# EAGLE design micromouse_schematic (EAGLE 8.6.3)
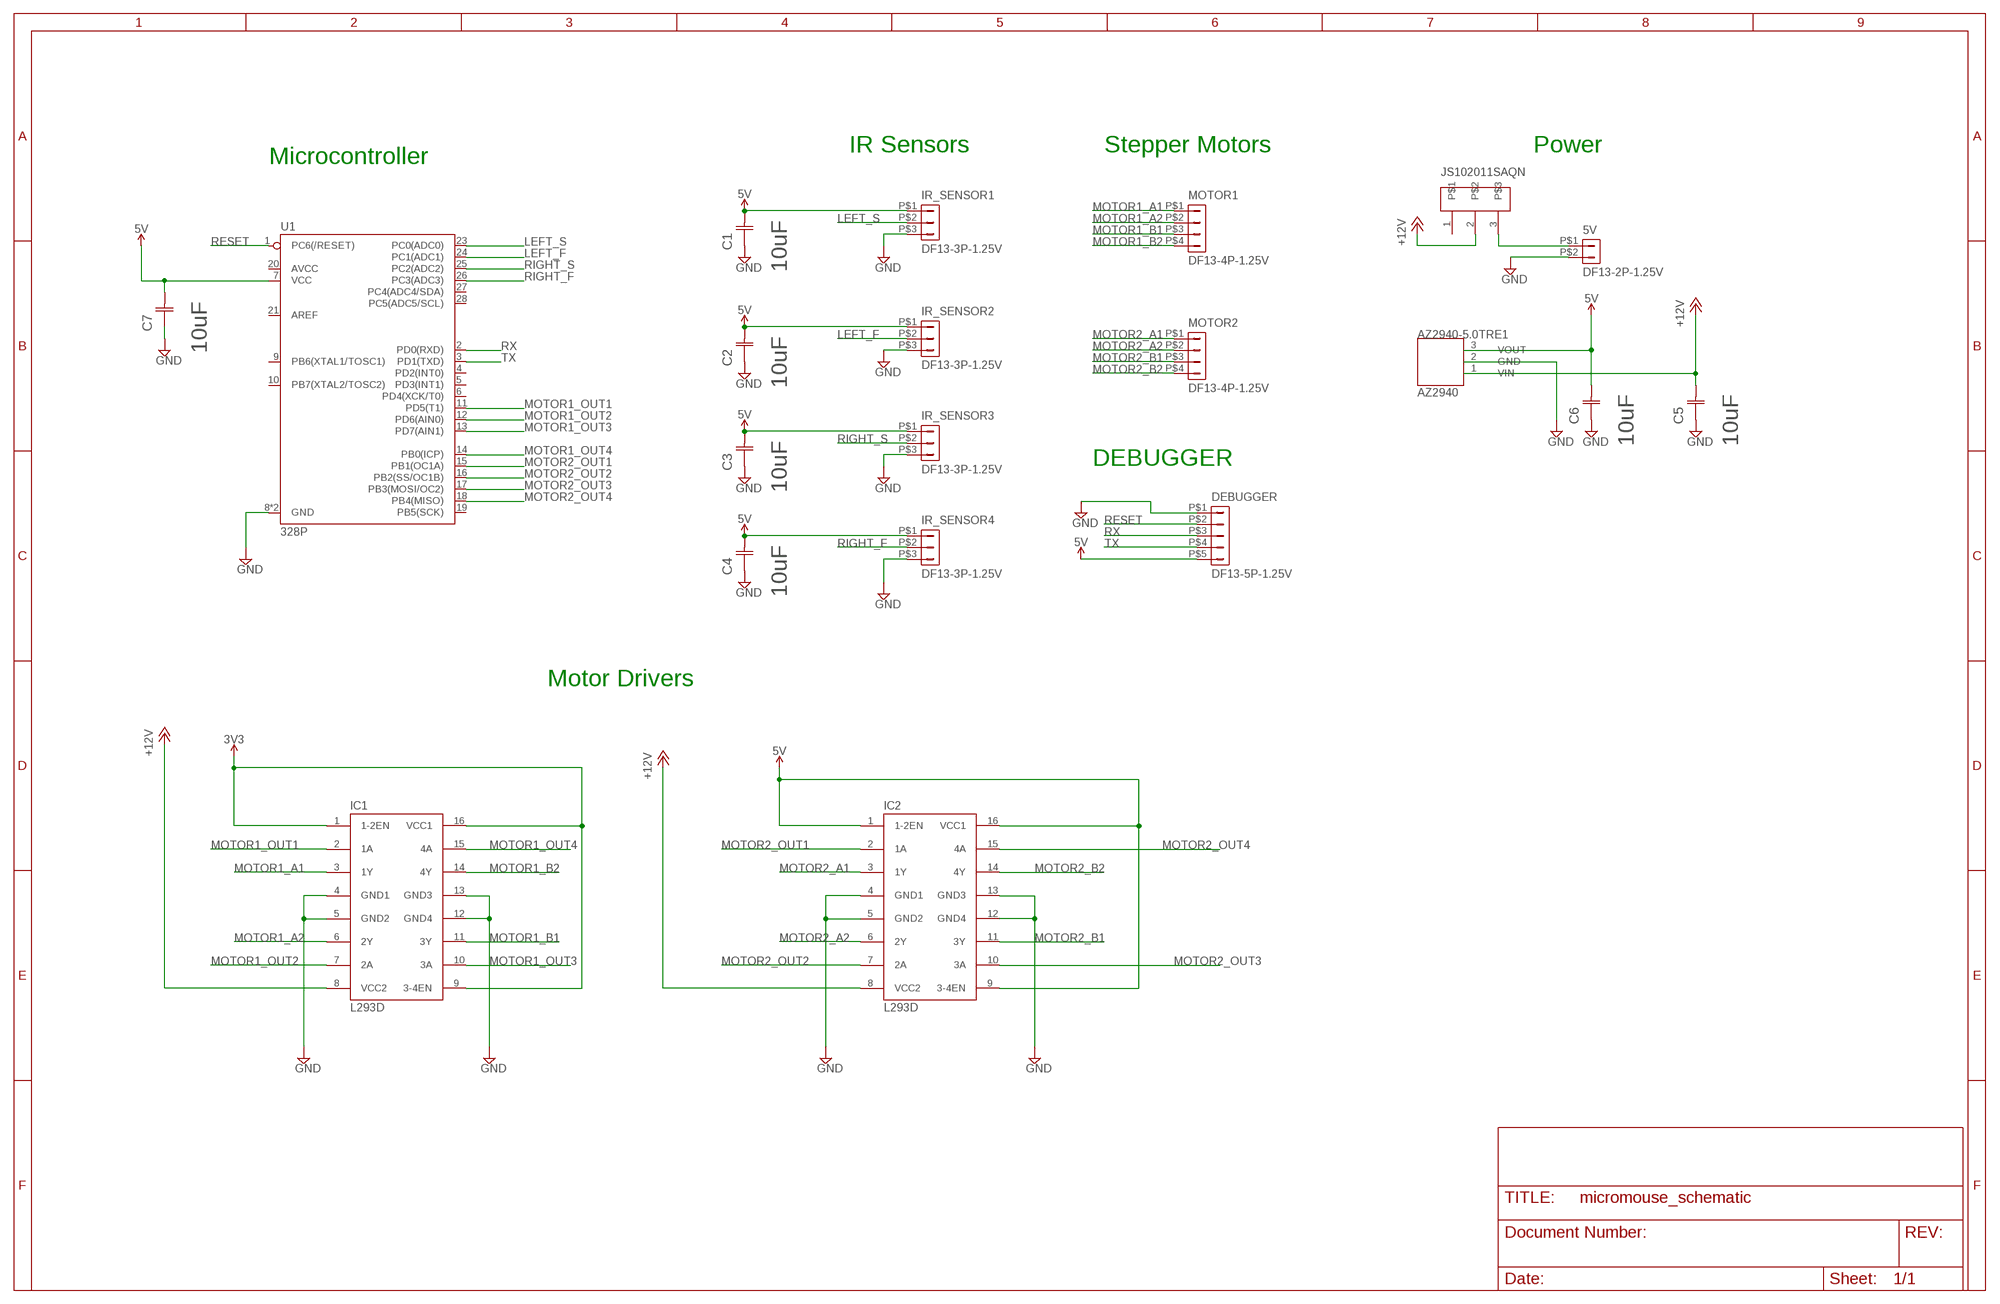
[diagram p0: schematic, sheet 1]

## Parts
5V  DF13-2P-1.25V  [DF13C-2P-1.25V]
AZ2940-5.0TRE1  AZ2940  [TO-252]
C1  10uF  GRM21BR61C106KE15L  [CAPC2013X135N]
C2  10uF  GRM21BR61C106KE15L  [CAPC2013X135N]
C3  10uF  GRM21BR61C106KE15L  [CAPC2013X135N]
C4  10uF  GRM21BR61C106KE15L  [CAPC2013X135N]
C5  10uF  GRM21BR61C106KE15L  [CAPC2013X135N]
C6  10uF  GRM21BR61C106KE15L  [CAPC2013X135N]
C7  10uF  GRM21BR61C106KE15L  [CAPC2013X135N]
DEBUGGER  DF13-5P-1.25V  [DF13C-5P-1.25V]
IC1  L293D  [DIL16]
IC2  L293D  [DIL16]
IR_SENSOR1  DF13-3P-1.25V  [DF13C-3P-1.25V]
IR_SENSOR2  DF13-3P-1.25V  [DF13C-3P-1.25V]
IR_SENSOR3  DF13-3P-1.25V  [DF13C-3P-1.25V]
IR_SENSOR4  DF13-3P-1.25V  [DF13C-3P-1.25V]
JS102011SAQN  JS102011SAQN  [JS102011SAQN]
MOTOR1  DF13-4P-1.25V  [DF13C-4P-1.25V]
MOTOR2  DF13-4P-1.25V  [DF13C-4P-1.25V]
U1  328P  ATMEGA328P_PDIP  [DIP28]

## Nets
+12V: AZ2940-5.0TRE1.1(VIN) C5.2(C2) IC1.8(VCC2) IC2.8(VCC2) JS102011SAQN.2
GND: 5V.P$2 AZ2940-5.0TRE1.2(GND) C1.1(C1) C2.1(C1) C3.1(C1) C4.1(C1) C5.1(C1) C6.1(C1) C7.1(C1) DEBUGGER.P$1 IC1.4(GND1) IC1.5(GND2) IC1.12(GND4) IC1.13(GND3) IC2.4(GND1) IC2.5(GND2) IC2.12(GND4) IC2.13(GND3) IR_SENSOR1.P$3 IR_SENSOR2.P$3 IR_SENSOR3.P$3 IR_SENSOR4.P$3 U1.8(GND) U1.22(GND)
LEFT_F: IR_SENSOR2.P$2 U1.24(PC1(ADC1))
LEFT_S: IR_SENSOR1.P$2 U1.23(PC0(ADC0))
MOTOR1_A1: IC1.3(1Y) MOTOR1.P$1
MOTOR1_A2: IC1.6(2Y) MOTOR1.P$2
MOTOR1_B1: IC1.11(3Y) MOTOR1.P$3
MOTOR1_B2: IC1.14(4Y) MOTOR1.P$4
MOTOR1_OUT1: IC1.2(1A) U1.11(PD5(T1))
MOTOR1_OUT2: IC1.7(2A) U1.12(PD6(AIN0))
MOTOR1_OUT3: IC1.10(3A) U1.13(PD7(AIN1))
MOTOR1_OUT4: IC1.15(4A) U1.14(PB0(ICP))
MOTOR2_A1: IC2.3(1Y) MOTOR2.P$1
MOTOR2_A2: IC2.6(2Y) MOTOR2.P$2
MOTOR2_B1: IC2.11(3Y) MOTOR2.P$3
MOTOR2_B2: IC2.14(4Y) MOTOR2.P$4
MOTOR2_OUT1: IC2.2(1A) U1.15(PB1(OC1A))
MOTOR2_OUT2: IC2.7(2A) U1.16(PB2(SS/OC1B))
MOTOR2_OUT3: IC2.10(3A) U1.17(PB3(MOSI/OC2))
MOTOR2_OUT4: IC2.15(4A) U1.18(PB4(MISO))
N$2: 5V.P$1 JS102011SAQN.3
RESET: DEBUGGER.P$2 U1.1(PC6(/RESET))
RIGHT_F: IR_SENSOR4.P$2 U1.26(PC3(ADC3))
RIGHT_S: IR_SENSOR3.P$2 U1.25(PC2(ADC2))
RX: DEBUGGER.P$3 U1.2(PD0(RXD))
TX: DEBUGGER.P$4 U1.3(PD1(TXD))
VCC: AZ2940-5.0TRE1.3(VOUT) C1.2(C2) C2.2(C2) C3.2(C2) C4.2(C2) C6.2(C2) C7.2(C2) DEBUGGER.P$5 IC1.1(1-2EN) IC1.9(3-4EN) IC1.16(VCC1) IC2.1(1-2EN) IC2.9(3-4EN) IC2.16(VCC1) IR_SENSOR1.P$1 IR_SENSOR2.P$1 IR_SENSOR3.P$1 IR_SENSOR4.P$1 U1.7(VCC) ; supply symbol labelled 5V, 3V3
Unconnected: JS102011SAQN.1 U1.4(PD2(INT0)) U1.5(PD3(INT1)) U1.6(PD4(XCK/T0)) U1.9(PB6(XTAL1/TOSC1)) U1.10(PB7(XTAL2/TOSC2)) U1.19(PB5(SCK)) U1.20(AVCC) U1.21(AREF) U1.27(PC4(ADC4/SDA)) U1.28(PC5(ADC5/SCL))

## Notes on the sheet
- IR Sensors | Stepper Motors | Power
- Microcontroller
- DEBUGGER
- Motor Drivers

## Library data of the parts
5V = con-hirose-df13:DF13-2P-1.25: DF13-2P 1.25mm Pitch Miniature Crimping Connector.; SPICEPREFIX: B
AZ2940-5.0TRE1 = nick_custom_library:AZ2940
C1-C7 = Murata_By_element14_Batch_1:GRM21BR61C106KE15L: CAPACITOR, 0805; MPN: GRM21BR61C106KE15L; OC_FARNELL: 1762635; OC_NEWARK: 35R0687; SUPPLIER: Murata; TOLERANCE: ±10%; VOLTAGERATING: 16V
DEBUGGER = con-hirose-df13:DF13-5P-1.25: DF13-5P 1.25mm Pitch Miniature Crimping Connector.
IC1 IC2 = st-microelectronics:L293D: PUSH-PULL 4 CHANNEL DRIVER; MPN: L293D; OC_FARNELL: 9589619; OC_NEWARK: 56P8249
IR_SENSOR1-IR_SENSOR4 = con-hirose-df13:DF13-3P-1.25: DF13-3P 1.25mm Pitch Miniature Crimping Connector.
JS102011SAQN = nick_custom_library:JS102011SAQN: JS102011SAQN SMD Switch
MOTOR1 MOTOR2 = con-hirose-df13:DF13-4P-1.25: DF13-4P 1.25mm Pitch Miniature Crimping Connector.
U1 = SparkFun-IC-Microcontroller:ATMEGA328P_PDIP: Atmel 328P Through hole ATMEGA328P uC used in the Arduino 32kb flash, 1k EEPROM, 2k SRAM Datasheet <http://www.sparkfun.com/datasheets/Components/SMD/ATMega328.pdf> SparkFun Products Storefront component: AVR 28 Pin 20MHz 32K 6A/D - ATMega328P <https://www.sparkfun.com/products/9061> (COM-09061) SparkFun Simon Says - Through-Hole Soldering Kit <https://www.sparkfun.com/products/10547> (KIT-10547) SparkFun Learn to Solder - Simon Says <https://www.sparkfun.com/products/13708> (KIT-13708) SparkFun BigTime Watch Kit <https://www.sparkfun.com/products/11734> (KIT-11734) SparkFun ClockIt <https://www.sparkfun.com/products/10930> (KIT-10930) SparkFun Serial Enabled LCD Kit <https://www.sparkfun.com/products/10097> (LCD-10097) SparkFun Simon Tilts - Through Hole Soldering Kit <https://www.sparkfun.com/products/12634> (KIT-12634) SparkFun Frequency Counter Kit <https://www.sparkfun.com/products/10140> (KIT-10140) FabFM Radio Kit <https://www.sparkfun.com/products/11043> (KIT-11043) SparkFun Binary Blaster Kit <https://www.sparkfun.com/products/12037> (KIT-12037) SparkFun Metro-Gnome <https://www.sparkfun.com/products/9236> (KIT-09236) ATmega328 with Arduino Optiboot (Uno) <https://www.sparkfun.com/products/10524> (DEV-10524); PROD_ID: IC-09136

## Board
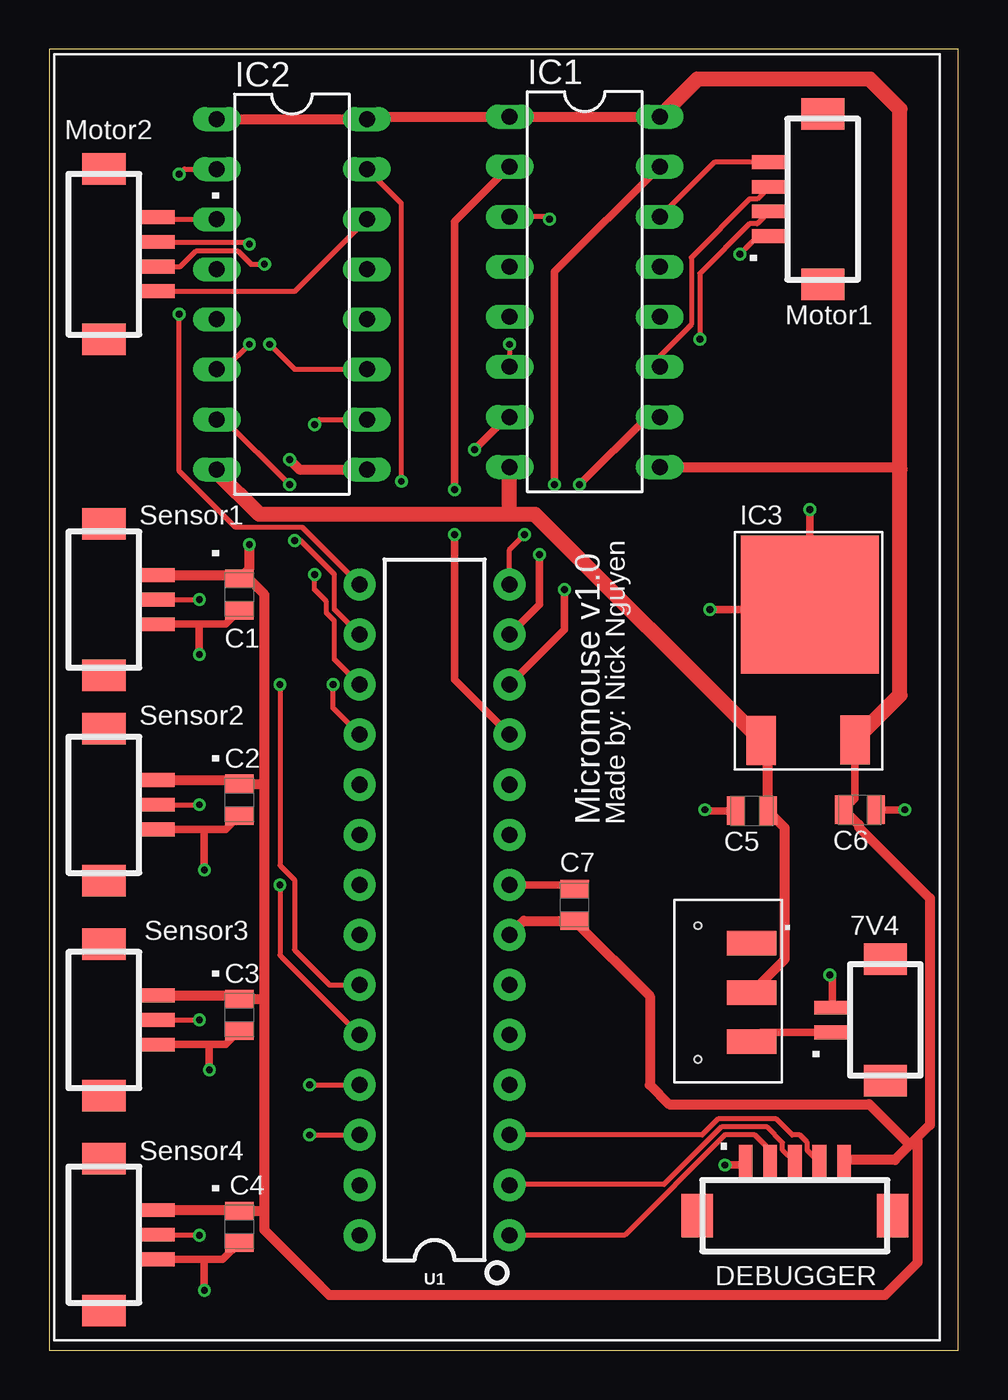
[diagram p1: board, top side]
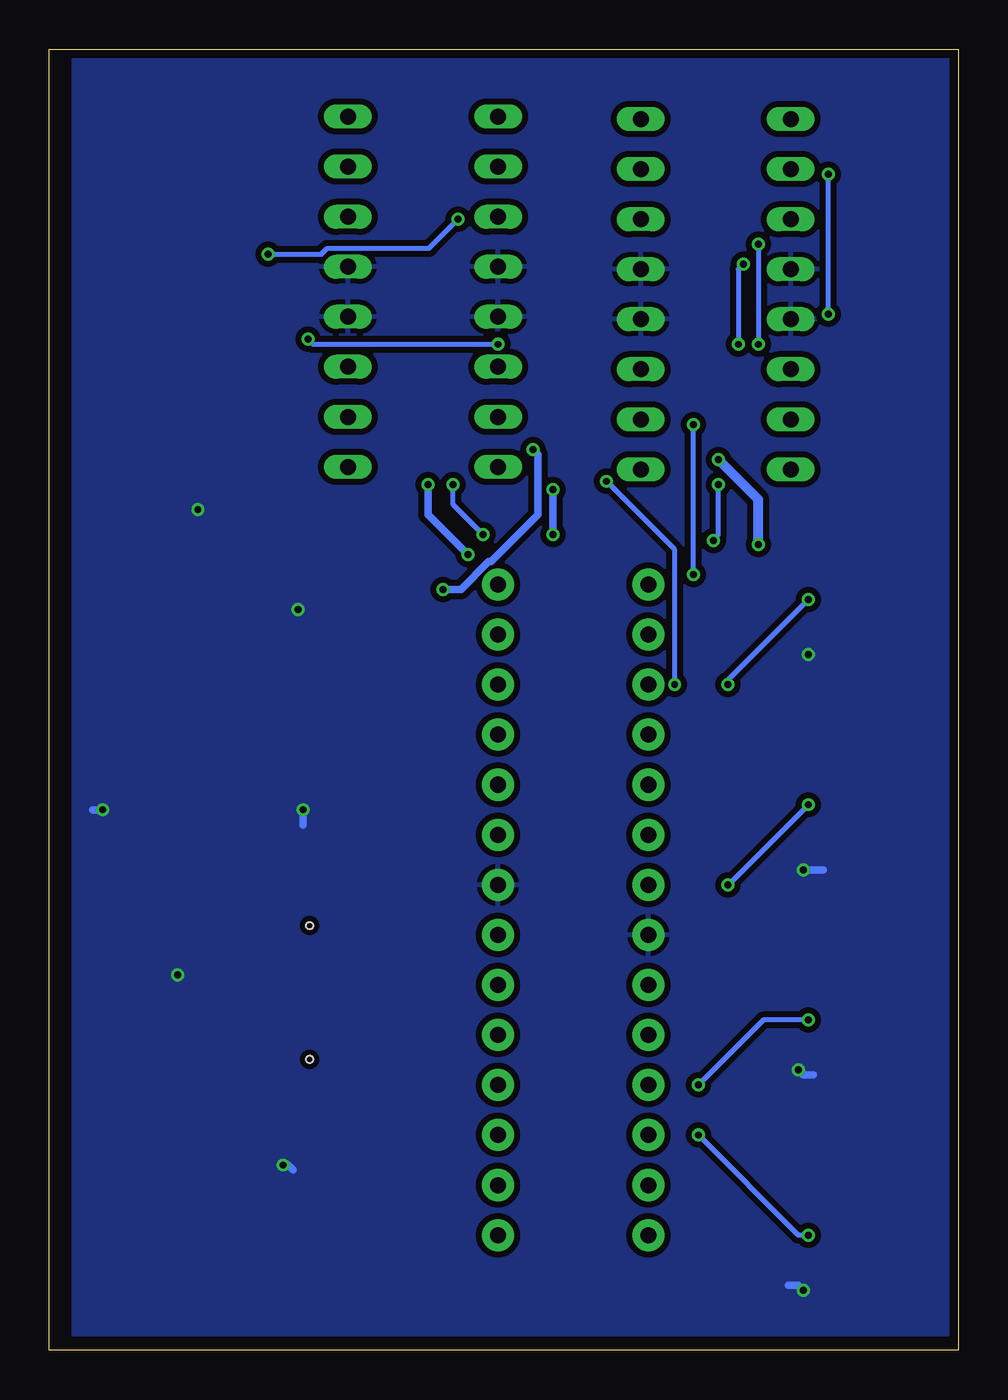
[diagram p2: board, bottom side, seen from below]

Size 46.15 x 66.03 mm. Coordinates in mm from the lower left corner, seen from the top.
Outline: 0,0 46.15,0 46.15,66.03 0,66.03 0,0
Copper layers (1*16): Top 0.035mm / dielectric 1.5mm / Bottom 0.035mm
Design rules "MF_4_mil_drill_2_Layer": minimum track width 5mil, minimum drill 4mil, track to track 5mil, track to pad 5mil, pad to pad 5mil, via to via 5mil, smd to smd 0mil, copper to edge 10mil, drill to drill 10mil, minimum pad ring 6mil, minimum via ring 6mil, stop-mask expansion 2mil, vias tented up to drill 25mil, thermal gap 10mil

### Footprints (pad centres in the part's own frame; a part is rotated, then mirrored left to right if it is on the bottom)
DF13C-2P-1.25V = smd 1.6 x 2.2: M$0 3.075,-1.8; M$1 -3.075,-1.8 | smd 0.7 x 1.8: P$1 -0.625,0.9; P$2 0.625,0.9
TO-252 = smd 1.499 x 2.489: 1 -2.464,-6.909; 3 2.286,-6.883 | smd 7.01 x 7.01: 2 0,0
CAPC2013X135N = smd 0.914 x 1.448: 1 -0.813,0; 2 0.813,0
DF13C-5P-1.25V = smd 1.6 x 2.2: M$0 4.95,-1.8; M$1 -4.95,-1.8 | smd 0.7 x 1.8: P$1 -2.5,0.9; P$2 -1.25,0.9; P$3 0,0.9; P$4 1.25,0.9; P$5 2.5,0.9
DIL16 = drill 0.813 long: 1 -8.89,-3.81; 2 -6.35,-3.81; 3 -3.81,-3.81; 4 -1.27,-3.81; 5 1.27,-3.81; 6 3.81,-3.81; 7 6.35,-3.81; 8 8.89,-3.81; 9 8.89,3.81; 10 6.35,3.81; 11 3.81,3.81; 12 1.27,3.81; 13 -1.27,3.81; 14 -3.81,3.81; 15 -6.35,3.81; 16 -8.89,3.81
DF13C-3P-1.25V = smd 1.6 x 2.2: M$0 3.85,-1.8; M$1 -3.85,-1.8 | smd 0.7 x 1.8: P$1 -1.25,0.9; P$2 0,0.9; P$3 1.25,0.9
JS102011SAQN = smd 1.245 x 2.515: 1 -2.489,0; 2 0,0; 3 2.489,0 | hole 0.35: -3.391,-2.731; 3.391,-2.731
DF13C-4P-1.25V = smd 1.6 x 2.2: M$0 4.325,-1.8; M$1 -4.325,-1.8 | smd 0.7 x 1.8: P$1 -1.875,0.9; P$2 -0.625,0.9; P$3 0.625,0.9; P$4 1.875,0.9
DIP28 = drill 0.813 pad 1.626: 1 -16.51,-3.81; 2 -13.97,-3.81; 3 -11.43,-3.81; 4 -8.89,-3.81; 5 -6.35,-3.81; 6 -3.81,-3.81; 7 -1.27,-3.81; 8 1.27,-3.81; 9 3.81,-3.81; 10 6.35,-3.81; 11 8.89,-3.81; 12 11.43,-3.81; 13 13.97,-3.81; 14 16.51,-3.81; 15 16.51,3.81; 16 13.97,3.81; 17 11.43,3.81; 18 8.89,3.81; 19 6.35,3.81; 20 3.81,3.81; 21 1.27,3.81; 22 -1.27,3.81; 23 -3.81,3.81; 24 -6.35,3.81; 25 -8.89,3.81; 26 -11.43,3.81; 27 -13.97,3.81; 28 -16.51,3.81

### Placement (x,y rotation side)
5V  40.64,16.76 90 top
AZ2940-5.0TRE1  38.61,37.85 0 top
C1  9.65,38.35 90 top
C2  9.65,27.94 90 top
C3  9.65,17.02 90 top
C4  9.65,6.27 90 top
C5  35.66,27.38 0 top
C6  41.15,27.43 180 top
C7  26.67,22.61 270 top
DEBUGGER  37.85,8.64 0 top
IC1  27.18,53.72 270 top
IC2  12.32,53.59 270 top
IR_SENSOR1  4.57,38.1 270 top
IR_SENSOR2  4.57,27.69 270 top
IR_SENSOR3  4.57,16.76 270 top
IR_SENSOR4  4.57,5.87 270 top
JS102011SAQN  35.66,18.16 270 top
MOTOR1  37.47,58.42 90 top
MOTOR2  4.57,55.63 270 top
U1  19.56,22.35 90 top

### Tracks (layer width: path | path; a pad name or v marks a point on that pad's centre or on a via)
+12V
  Top 0.508: JS102011SAQN.2 37.34,19.84 37.34,26.52 C5.2 36.47,30.61 AZ2940-5.0TRE1.1
  Top 0.762: AZ2940-5.0TRE1.1 24.66,42.42 23.37,42.42 | 23.37,42.42 10.67,42.42 8.51,44.58 IC2.8 | 23.37,42.42 IC1.8
GND  (via drill 0.35)
  Top 0.381: IR_SENSOR1.P$3 7.62,36.85 | 7.62,36.85 8.96,36.85 C1.1 | IR_SENSOR2.P$3 7.87,26.44 | 7.87,26.44 8.96,26.44 C2.1 | IR_SENSOR3.P$3 8.13,15.51 | 8.13,15.51 8.96,15.51 C3.1 | IR_SENSOR4.P$3 7.87,4.62 | 7.87,4.62 8.81,4.62 C4.1 | U1.8 26.47,23.62 C7.1 | C6.1 v43.43,27.43 | C5.1 33.33,27.38 v33.27,27.43 | DEBUGGER.P$1 35.21,9.4 v34.29,9.4 | 7.87,4.62 v7.87,3.05 | 8.13,15.51 v8.13,14.22 | 7.87,26.44 v7.87,24.38 | 7.62,36.85 v7.62,35.31 | v33.53,37.59 38.35,37.59 AZ2940-5.0TRE1.2 v38.61,42.67 | 5V.P$2 39.74,18.93 v39.62,19.05
  Bottom 0.381: v43.43,27.43 43.94,27.43 | v33.27,27.43 33.27,26.67 | v34.29,9.4 34.04,9.4 33.78,9.14 | v7.87,3.05 8.13,3.3 8.64,3.3 | v8.13,14.22 7.87,13.97 7.37,13.97 | v7.87,24.38 6.86,24.38
  pour Bottom (isolate 0.305): 0.51,65.53 44.96,65.53 44.96,0.76 0.51,0.76
LEFT_F  (via drill 0.35)
  Top 0.254: IR_SENSOR2.P$2 v7.62,27.69 | v11.71,23.62 11.71,20.04 U1.24
  Bottom 0.254: v7.62,27.69 11.68,23.62 v11.71,23.62
LEFT_S  (via drill 0.35)
  Top 0.254: IR_SENSOR1.P$2 v7.62,38.1 | v11.71,33.78 11.71,24.61 12.45,23.88 12.45,20.32 14.22,18.54 U1.23
  Bottom 0.254: v7.62,38.1 11.71,34.01 v11.71,33.78
MOTOR1_A1  (via drill 0.35)
  Top 0.254: MOTOR1.P$1 35.97,56.55 v35.05,55.63 | v25.4,57.4 25.27,57.53 IC1.3
  Bottom 0.254: v35.05,55.63 32.34,55.63 32.04,55.93 26.87,55.93 v25.4,57.4
MOTOR1_A2  (via drill 0.35)
  Top 0.254: MOTOR1.P$2 35.94,57.17 35.55,57.17 33.02,54.65 v33.02,51.31 | v23.37,51.05 IC1.6
  Bottom 0.254: v33.02,51.31 32.77,51.05 v23.37,51.05
MOTOR1_B1
  Top 0.254: MOTOR1.P$3 35.94,58.42 35.55,58.42 32.59,55.46 32.59,52.06 30.99,50.46 IC1.11
MOTOR1_B2
  Top 0.254: MOTOR1.P$4 33.75,60.3 IC1.14
MOTOR1_OUT1  (via drill 0.35)
  Top 0.381: IC1.2 20.57,57.28 v20.57,43.69 | v20.57,41.4 20.57,34.04 U1.11
  Bottom 0.381: v20.57,43.69 v20.57,41.4
MOTOR1_OUT2  (via drill 0.35)
  Top 0.381: U1.12 26.16,36.58 v26.16,38.61 | v21.59,45.72 23.24,47.37 IC1.7
  Bottom 0.381: v26.16,38.61 25.26,38.61 23.85,40.02 23.74,40.02 21.34,42.42 21.34,45.47 v21.59,45.72
MOTOR1_OUT3  (via drill 0.35)
  Top 0.381: U1.13 24.89,37.85 v24.89,40.39 | v26.92,43.94 30.35,47.37 IC1.10
  Bottom 0.381: v24.89,40.39 26.92,42.42 v26.92,43.94
MOTOR1_OUT4  (via drill 0.35)
  Top 0.254: U1.14 23.37,40.64 v24.13,41.4
  Top 0.381: v25.65,43.94 25.65,54.74 IC1.15
  Bottom 0.254: v24.13,41.4 25.65,42.93 v25.65,43.94
MOTOR2_A1
  Top 0.254: MOTOR2.P$1 5.57,57.4 IC2.3
MOTOR2_A2  (via drill 0.35)
  Top 0.254: MOTOR2.P$2 10.04,56.25 v10.16,56.13 | v10.16,51.05 8.89,49.78 IC2.6
  Bottom 0.254: v10.16,56.13 v10.16,51.05
MOTOR2_B1  (via drill 0.35)
  Top 0.254: MOTOR2.P$3 6.66,55 7.46,55.8 9.56,55.8 10.24,55.12 v10.92,55.12 | v11.18,51.05 12.45,49.78 IC2.11
  Bottom 0.254: v10.92,55.12 11.18,54.86 v11.18,51.05
MOTOR2_B2
  Top 0.254: MOTOR2.P$4 12.48,53.75 IC2.14
MOTOR2_OUT1  (via drill 0.35)
  Top 0.254: U1.15 12.85,41.76 9.47,41.76 6.6,44.62 v6.6,52.58 | v6.6,59.69 6.86,59.94 IC2.2
  Bottom 0.254: v6.6,52.58 v6.6,59.69
MOTOR2_OUT2  (via drill 0.35)
  Top 0.254: U1.16 14.48,37.59 14.48,39.37 12.75,41.1 v12.45,41.1 | v12.19,43.94 8.89,47.24 IC2.7
  Bottom 0.254: v12.45,41.1 12.19,41.35 v12.19,43.94
MOTOR2_OUT3  (via drill 0.35)
  Top 0.254: U1.17 14.48,35.05 14.48,37.02 14.07,37.42 14.07,38 13.46,38.61 v13.46,39.37 | v13.46,46.99 13.72,47.24 IC2.10
  Bottom 0.254: v13.46,39.37 v13.46,46.99
MOTOR2_OUT4  (via drill 0.35)
  Top 0.254: U1.18 14.41,32.58 v14.41,33.78 | v17.87,44.1 17.87,58.2 IC2.15
  Bottom 0.254: v14.41,33.78 14.41,40.64 v17.87,44.1
N$2
  Top 0.381: 5V.P$1 36.13,16.14 JS102011SAQN.3
RESET
  Top 0.254: DEBUGGER.P$2 36.6,10.14 35.81,10.92 34.29,10.92 29.21,5.84 U1.1
RIGHT_F  (via drill 0.35)
  Top 0.254: IR_SENSOR4.P$2 7.6,5.87 v7.62,5.84 | v13.21,10.92 U1.26
  Bottom 0.254: v7.62,5.84 8.13,5.84 v13.21,10.92
RIGHT_S  (via drill 0.35)
  Top 0.254: IR_SENSOR3.P$2 v7.62,16.76 | v13.21,13.46 U1.25
  Bottom 0.254: v7.62,16.76 9.91,16.76 v13.21,13.46
RX
  Top 0.254: DEBUGGER.P$3 37.23,10.16 37.23,10.55 36.45,11.33 34.12,11.33 31.21,8.41 23.4,8.41 U1.2
TX
  Top 0.254: DEBUGGER.P$4 38.48,10.16 38.48,10.55 38.11,10.92 37.71,10.92 36.9,11.73 33.95,11.73 33.14,10.92 U1.3
VCC  (via drill 0.35)
  Top 0.381: AZ2940-5.0TRE1.3 40.89,27.99 C6.2
  Top 0.508: C6.2 41.1,26.67 41.1,26.54 44.7,22.93 44.7,11.43 44.07,10.8 | 44.07,10.8 43.69,10.41 | 43.69,10.41 42.93,9.65 40.46,9.65 DEBUGGER.P$5 | 44.07,10.8 44.07,4.45 42.42,2.79 14.22,2.79 10.92,6.1 10.92,7.11 | 10.92,7.11 10.92,17.78 | 10.92,17.78 10.92,28.96 | 10.92,28.96 10.92,38.35 10.11,39.17 C1.2 | IR_SENSOR1.P$1 9.47,39.35 C1.2 | IR_SENSOR2.P$1 9.47,28.94 C2.2 10.72,28.75 10.92,28.96 | IR_SENSOR3.P$1 9.47,18.01 C3.2 10.87,17.83 10.92,17.78 | IR_SENSOR4.P$1 9.62,7.12 C4.2 10.9,7.09 10.92,7.11 | U1.7 24.08,21.79 C7.2 30.48,17.98 30.48,13.46 31.46,12.48 41.62,12.48 43.69,10.41 | IC2.1 IC2.16 16.26,62.61 IC1.1 IC1.16 | IC1.9 43.05,44.83 43.18,44.7 | C1.2 10.16,39.67 v10.16,40.89 | v12.19,45.21 12.7,44.7 IC2.9
  Top 0.762: AZ2940-5.0TRE1.3 43.18,33.25 43.18,44.7 43.18,62.99 41.66,64.52 32.89,64.52 IC1.16
  Bottom 0.508: v10.16,40.89 10.16,43.18 v12.19,45.21

### Text on the board
tPlace: Motor2 | Motor1 | Sensor1 | IC3 | Sensor2 | Micromouse v1.0 | Made by: Nick Nguyen | Sensor3 | 7V4 | Sensor4 | DEBUGGER